# Altium project usbTosata.PrjPCB
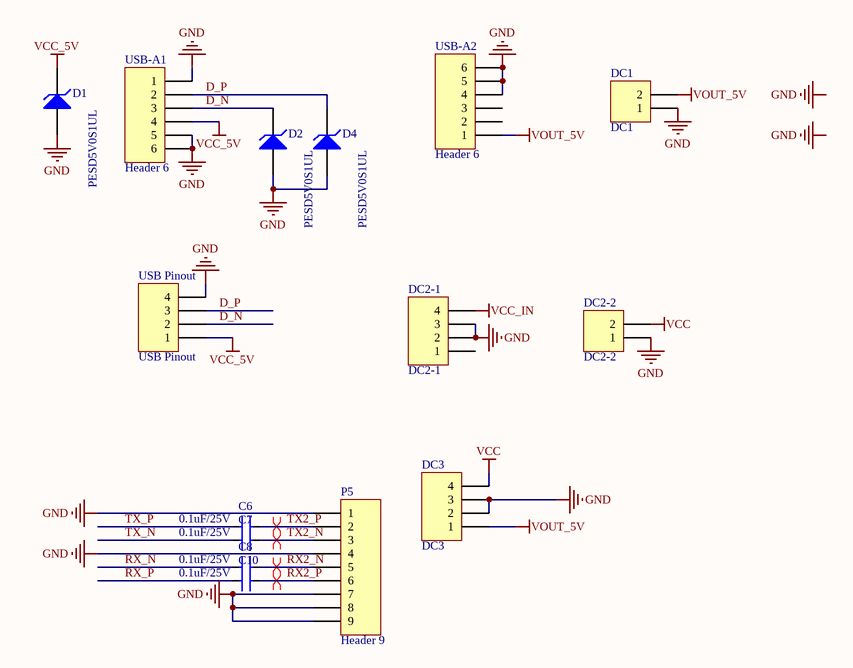
[diagram p0: CONNECTOR.SchDoc]
1 sheet, 15 parts. Net scope: global (net labels, ports and power ports of the same name join across sheets).
Board file: PCB1.PcbDoc

## Sheet CONNECTOR.SchDoc
size A4

### Parts
C6  0.1uF/25V  [0603C]
C7  0.1uF/25V  [0603C]
C8  0.1uF/25V  [0603C]
C10  0.1uF/25V  [0603C]
D1  PESD5V0S1UL  [0402R]
D2  PESD5V0S1UL  [0402R]
D4  PESD5V0S1UL  [0402R]
DC1  DC1  [2X2MMZ]
DC2-1  DC2-1  [DC005]
DC2-2  DC2-2  [2X2MMZ]
DC3  DC3  [2X4MMZ]
P5  Header 9  [SATA 7P]
USB-A1  Header 6  [USB-A-C]
USB-A2  Header 6  [USB-A-C]
USB_Pinout  USB Pinout  [sip-4l]

### Nets
GND: D1.1(A) D2.1(A) D4.1(A) DC1.1 DC2-1.2 DC2-1.3 DC2-2.1 DC3.2 DC3.3 P5.1 P5.4 P5.7 P5.8 P5.9 USB-A1.1 USB-A1.5 USB-A1.6 USB-A2.4 USB-A2.5 USB-A2.6 USB_Pinout.4
VCC: DC2-2.2 DC3.4
VCC_5V: D1.2(K) USB-A1.4 USB_Pinout.1
VCC_IN: DC2-1.4
VOUT_5V: DC1.2 DC3.1 USB-A2.1
D_N: D2.2(K) USB-A1.3 USB_Pinout.2
D_P: D4.2(K) USB-A1.2 USB_Pinout.3
RX2_N: C8.2 P5.5
RX2_P: C10.2 P5.6
RX_N: C8.1
RX_P: C10.1
TX2_N: C7.2 P5.3
TX2_P: C6.2 P5.2
TX_N: C7.1
TX_P: C6.1

Not connected (* = marked no-connect by the designer): DC2-1 1; USB-A2 2 3

### Layout directives
differential pair: RX2_N, RX2_P, TX2_N, TX2_P

### Notes on the sheet
- Labels drawn without touching a wire or pin: GND

### Library data of the parts
C6-C8 C10 = 0.01UF: CCX85-103
D1 D2 D4 = D Zener: Zener Diode; Published: 8-Jun-2000; LatestRevisionDate: 17-Jul-2002; LatestRevisionNote: Re-released for DXP Platform.; PackageReference: DIODE-0.7; Publisher: Altium Limited
DC1 DC2-2 = Header 2: Header, 2-Pin; LatestRevisionDate: 17-Jul-2002; LatestRevisionNote: Re-released for DXP Platform.; Publisher: Altium Limited
DC2-1 DC3 USB_Pinout = Header 4: Header, 4-Pin; LatestRevisionDate: 17-Jul-2002; LatestRevisionNote: Re-released for DXP Platform.; Publisher: Altium Limited
P5 = Header 9: Header, 9-Pin; LatestRevisionDate: 17-Jul-2002; LatestRevisionNote: Re-released for DXP Platform.; Publisher: Altium Limited
USB-A1 USB-A2 = Header 6: Header, 6-Pin; LatestRevisionDate: 17-Jul-2002; LatestRevisionNote: Re-released for DXP Platform.; Publisher: Altium Limited